# Altium project Apollo_FPC_Electrical_To_PD.PrjPcb
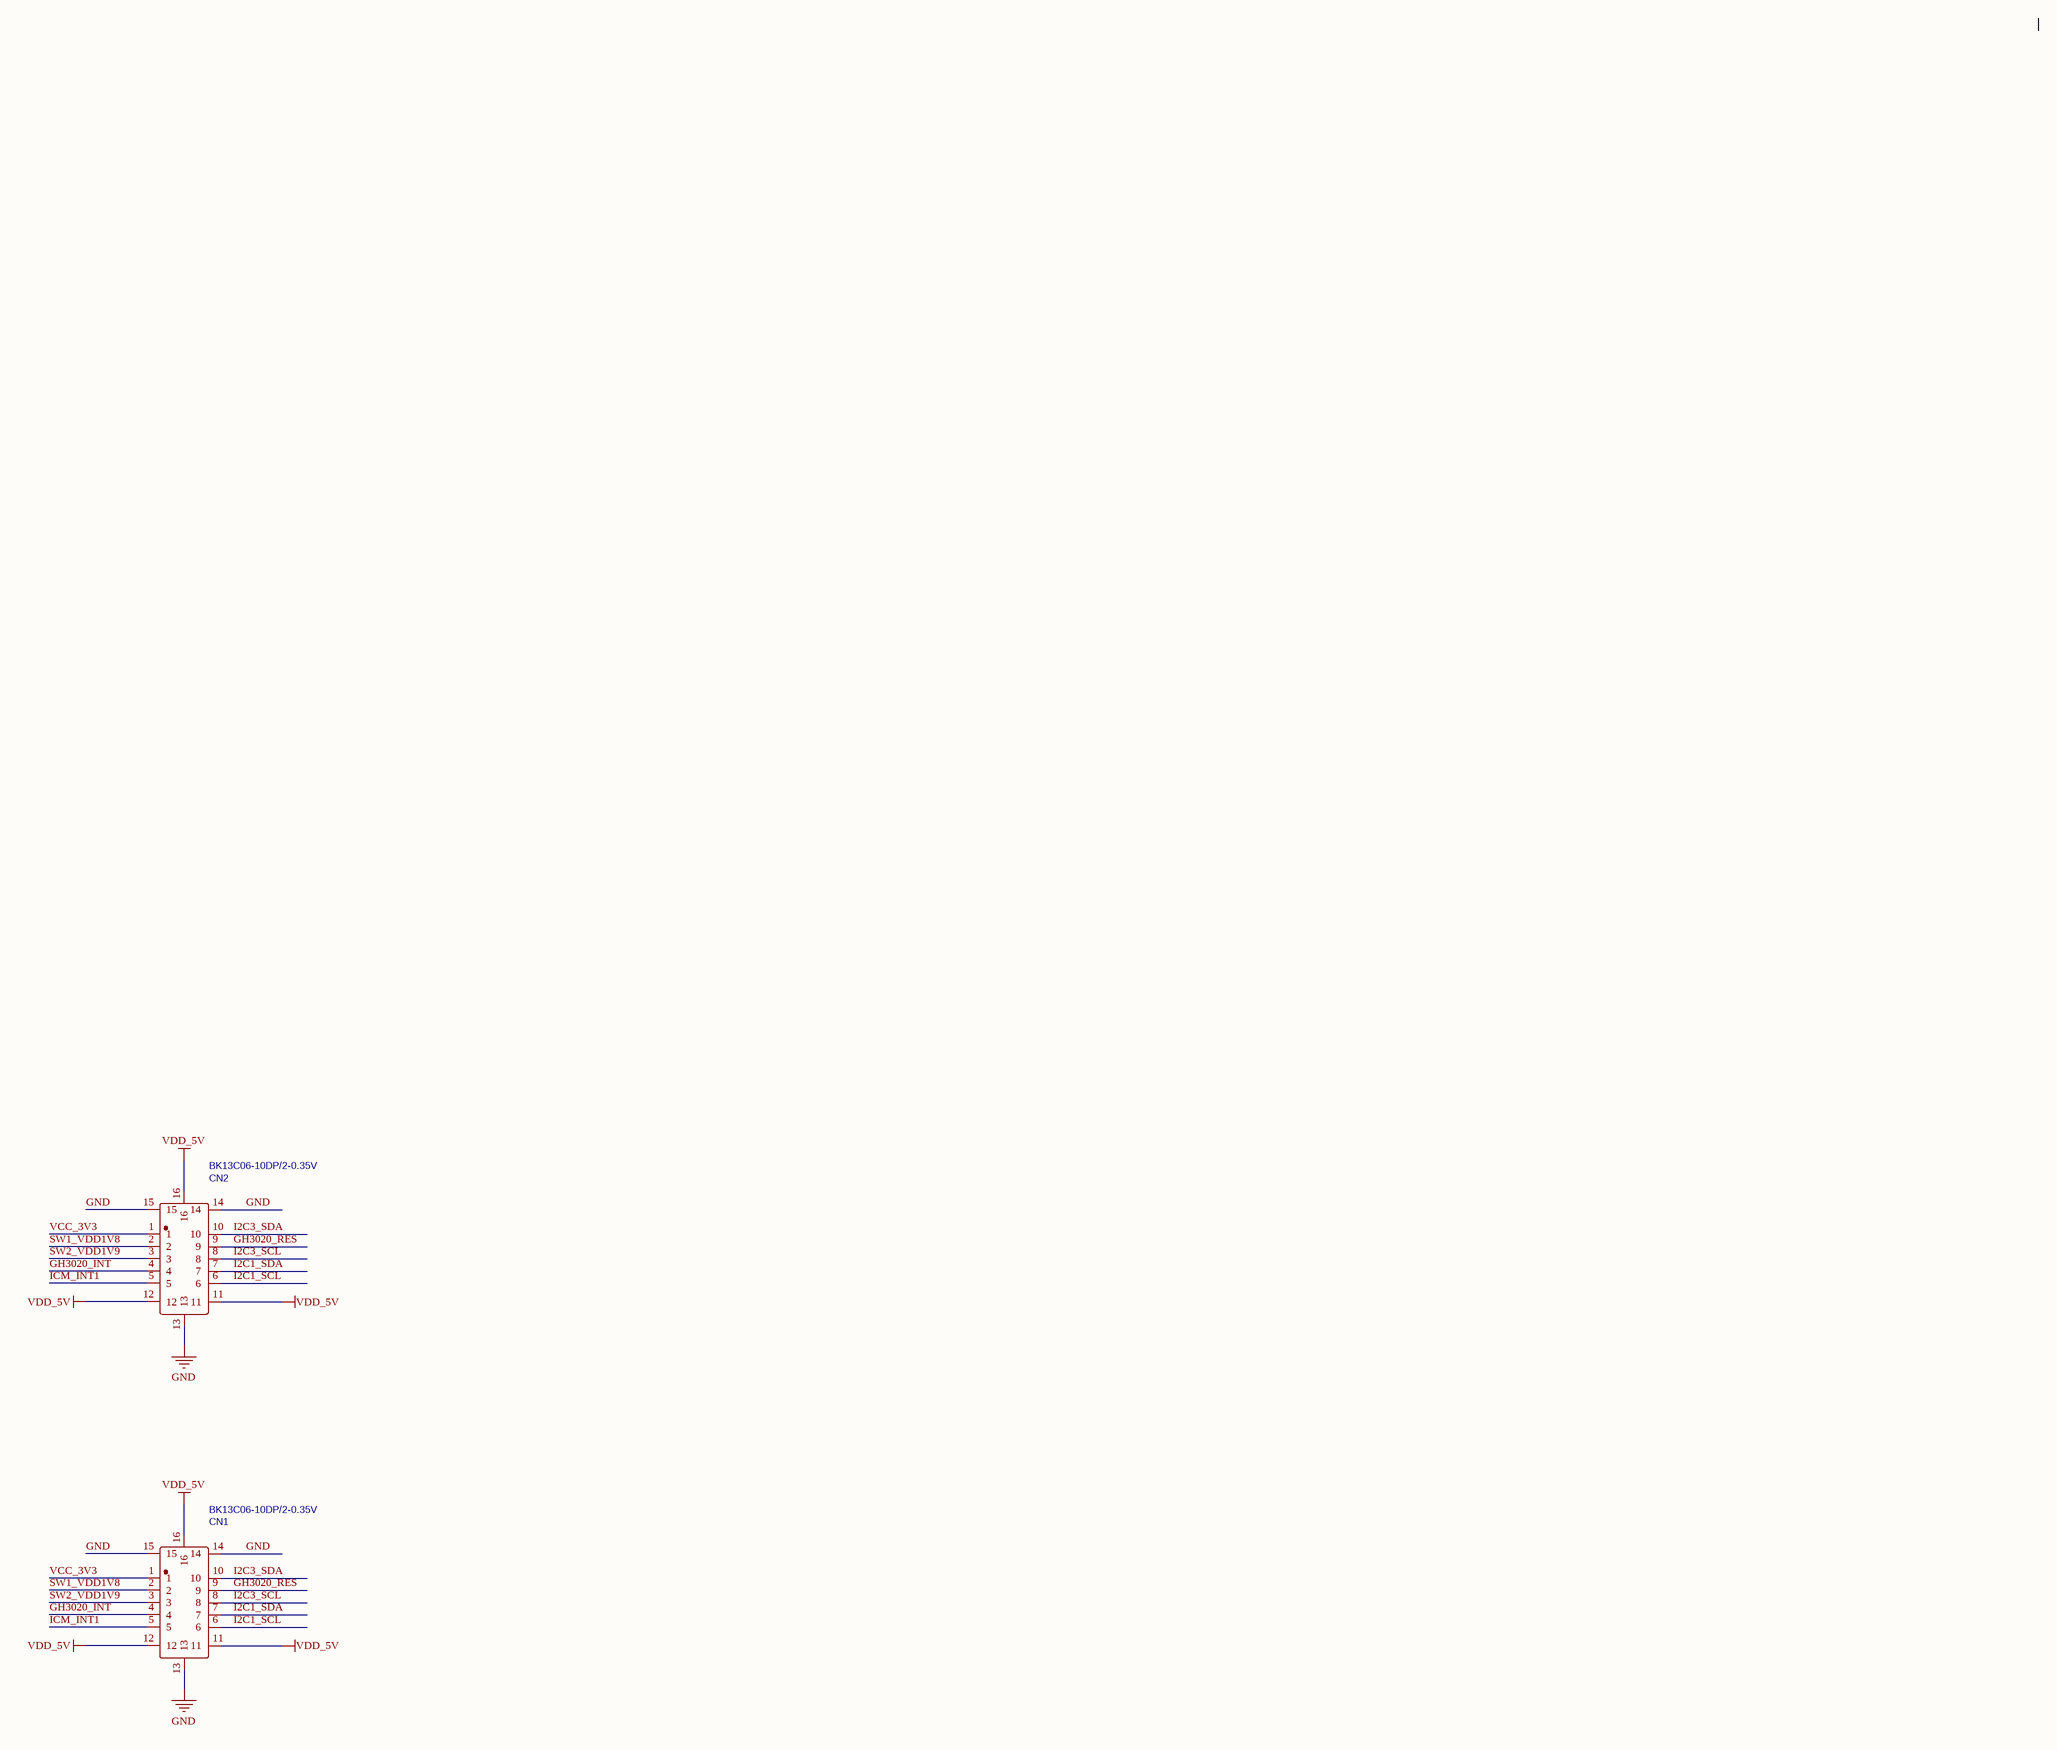
[diagram p0: FPC_ES_TO_PD.SchDoc]
1 sheet, 2 parts. Net scope: global (net labels, ports and power ports of the same name join across sheets).
Board file: FPC_ES_TO_PD.PcbDoc

## Sheet FPC_ES_TO_PD.SchDoc
size A4; SheetNumber: 1; SheetTotal: 1

### Parts
CN1  BK13C06-10DP/2-0.35V  [CONN-SMD_10P-P0.35_BK13C06-10DP]
CN2  BK13C06-10DP/2-0.35V  [CONN-SMD_10P-P0.35_BK13C06-10DP]

### Nets
GND: CN1.13 CN1.14 CN1.15 CN2.13 CN2.14 CN2.15
VDD_5V: CN1.11 CN1.12 CN1.16 CN2.11 CN2.12 CN2.16
GH3020_INT: CN1.4 CN2.4
GH3020_RES: CN1.9 CN2.9
I2C1_SCL: CN1.6 CN2.6
I2C1_SDA: CN1.7 CN2.7
I2C3_SCL: CN1.8 CN2.8
I2C3_SDA: CN1.10 CN2.10
ICM_INT1: CN1.5 CN2.5
SW1_VDD1V8: CN1.2 CN2.2
SW2_VDD1V9: CN1.3 CN2.3
VCC_3V3: CN1.1 CN2.1

### Library data of the parts
CN1 CN2 = 10pin_dp_BK13C06-10DP/2-0.35V: Manufacturer: null; Contributor: lcsc; Supplier: LCSC; Supplier Part: C3040902; Manufacturer Part: BK13C06-10DP/2-0.35V; JLCPCB Part Class: Extended Part; spicePre: C; spiceSymbolName: BK13C06-10DP/2-0.35V